# EasyEDA Pro project ProPrj_基于STM32的多功能串口分析仪_2025-03-12.epro, schematic flash
Board Name: flash小板; Create Date: 2025-01-06; Page Name: P1; Project Name: 基于STM32的多功能串口分析仪; Schematic Name: flash; Update Date: 2025-01-06; Company: 嘉立创EDA; Page Size: A4; Version: V1.0
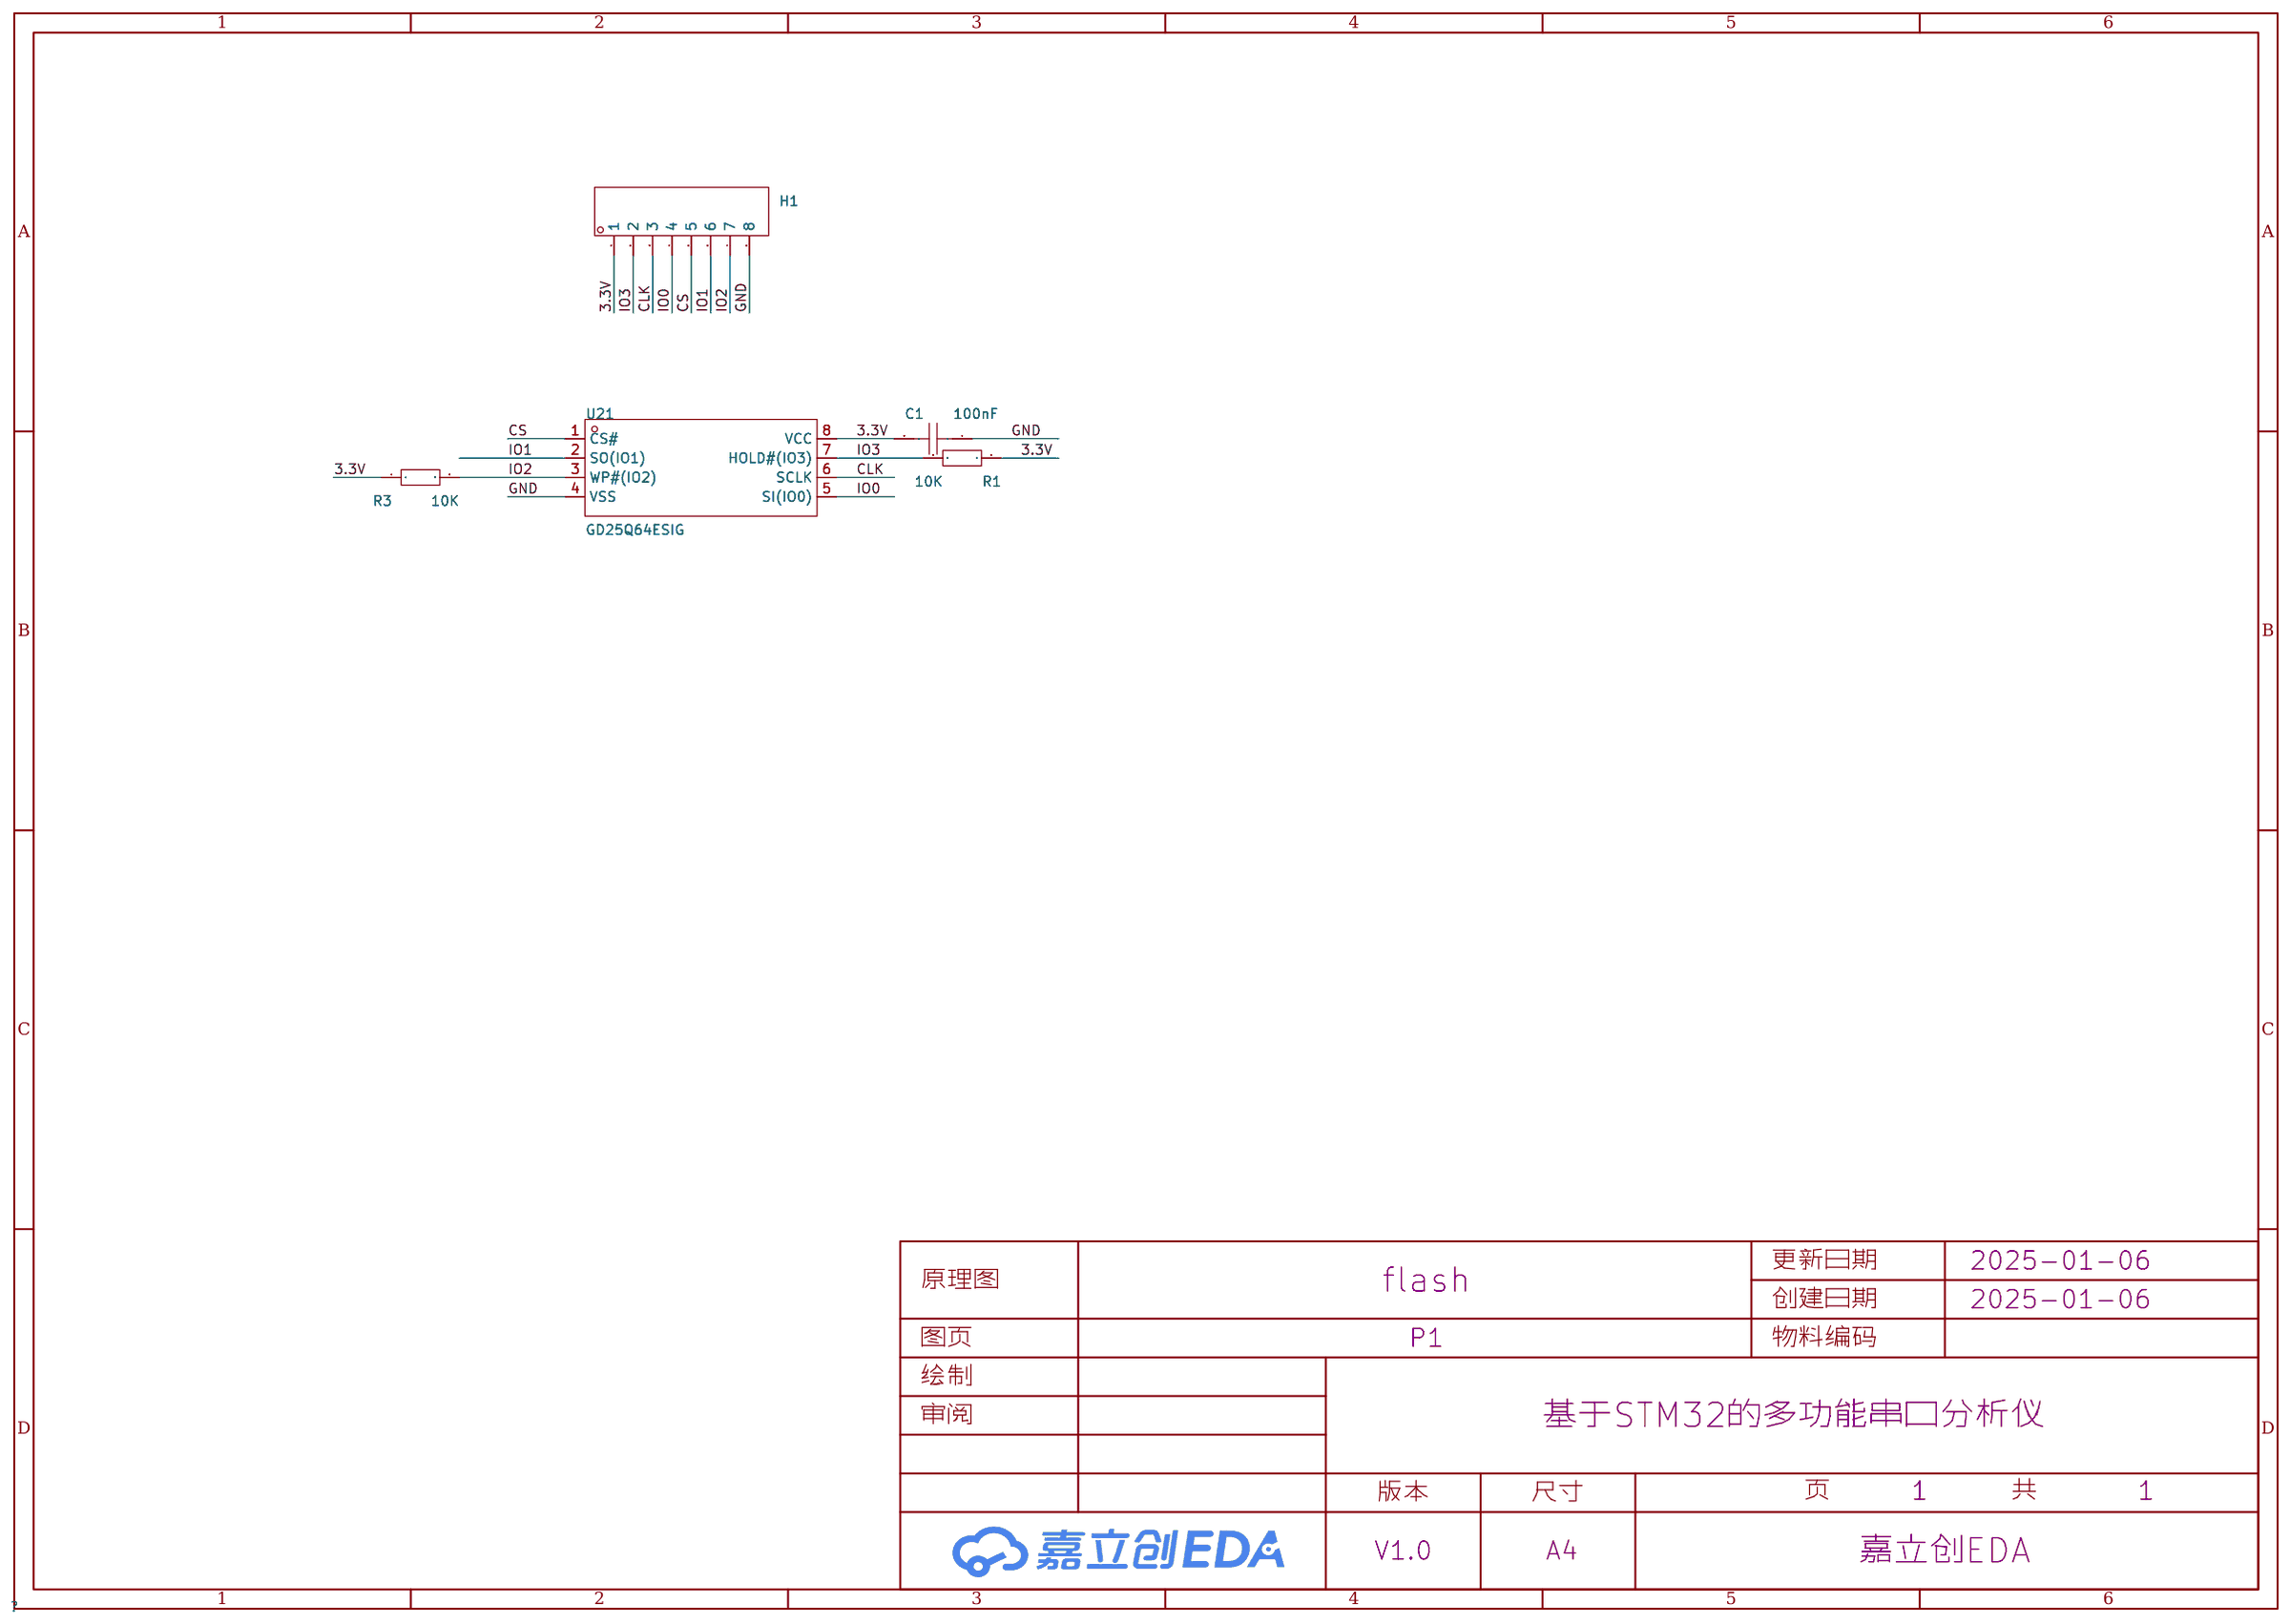
[diagram p0: schematic sheet]

## Parts
C1  100nF  [C0603]
H1  -  [HDR-TH_8P-P2.54-V-M]
R1  10K  [R0603]
R3  10K  [R0603]
U21  GD25Q64ESIG  [SOP-8_L5.3-W5.3-P1.27-LS8.0-BL]

## Library data of the parts
C1 = CAP_0603: Supplier Footprint: 0603
H1 = HDR-M_2.54_1x8P: Supplier Part: C124381; Supplier Footprint: 插件
R1 R3 = Res_0603: Supplier Footprint: 0603
U21 = GD25Q64ESIG: 存储容量:64Mbit;时钟频率(fc):133MHz;; Supplier Part: C2685734; Manufacturer: GigaDevice(兆易创新); Supplier Footprint: SOP-8-208mil; Datasheet: https://atta.szlcsc.com/upload/public/pdf/source/20210430/C2831359_BCFE71AD549651B3F601806E667453CB.pdf; Supplier: LCSC; Memory Size: 64Mbit; Clock Frequency (fc): 133MHz; Supply Voltage: 2.7V~3.6V; Operating Temperature: -40℃~+85℃

## Nets
3.3V: C1.2 H1.1 R1.1 R3.1 U21.8(VCC)
GND: C1.1 H1.8 U21.4(VSS)
CLK: H1.3 U21.6(SCLK)
CS: H1.5 U21.1(CS#)
IO0: H1.4 U21.5(SI(IO0))
IO1: H1.6 U21.2(SO(IO1))
IO2: H1.7 R3.2 U21.3(WP#(IO2))
IO3: H1.2 R1.2 U21.7(HOLD#(IO3))
